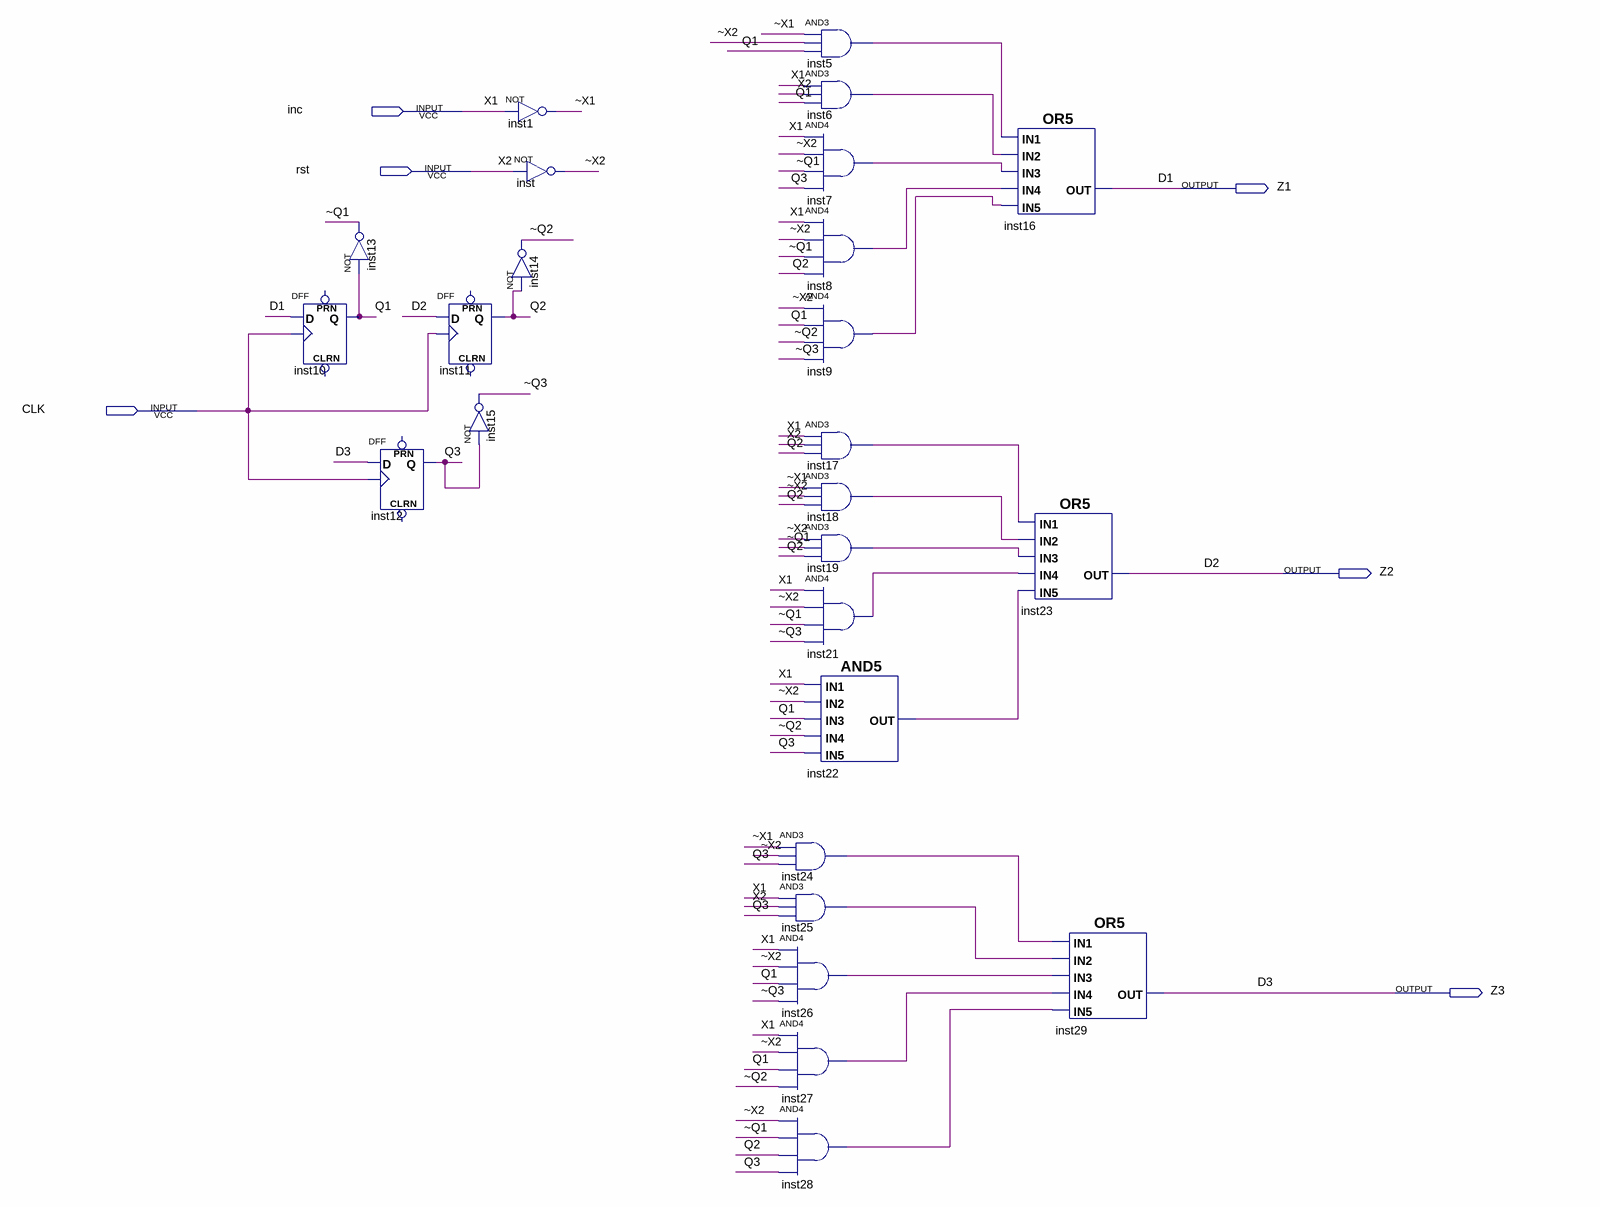
[diagram p0: schematic sheet]
// Quartus schematic PORT_dz2.bdf as structural Verilog: 26 symbols, 6 pins
module PORT_dz2 (
  input  inc,
  input  rst,
  input  CLK,
  output Z1,
  output Z2,
  output Z3
);

  wire inst5_out, inst6_out, inst7_out, inst8_out, inst9_out, inst17_out, inst18_out, inst19_out, inst21_out,
       inst22_out, inst24_out, inst25_out, inst26_out, inst27_out, inst28_out, Q1, Q2, Q3, \~Q1 , \~Q2 ,
       \~Q3 , \~X1 , \~X2 ;

  not inst13 (\~Q1 , Q1);
  DFF inst10 (.CLK(CLK), .D(Z1), .Q(Q1));  // open: CLRN, PRN
  DFF inst12 (.CLK(CLK), .D(Z3), .Q(Q3));  // open: CLRN, PRN
  DFF inst11 (.CLK(CLK), .D(Z2), .Q(Q2));  // open: CLRN, PRN
  not inst15 (\~Q3 , Q3);
  not inst1 (\~X1 , inc);
  not inst (\~X2 , rst);
  not inst14 (\~Q2 , Q2);
  and inst5 (inst5_out, \~X1 , \~X2 , Q1);
  and inst6 (inst6_out, inc, rst, Q1);
  and inst7 (inst7_out, inc, \~X2 , \~Q1 , Q3);
  and inst8 (inst8_out, inc, \~X2 , \~Q1 , Q2);
  and inst9 (inst9_out, \~X2 , Q1, \~Q2 , \~Q3 );
  and inst17 (inst17_out, inc, rst, Q2);
  and inst18 (inst18_out, \~X1 , \~X2 , Q2);
  and inst19 (inst19_out, \~X2 , \~Q1 , Q2);
  and inst21 (inst21_out, inc, \~X2 , \~Q1 , \~Q3 );
  and inst22 (inst22_out, inc, \~X2 , Q1, \~Q2 , Q3);
  and inst24 (inst24_out, \~X1 , \~X2 , Q3);
  and inst25 (inst25_out, inc, rst, Q3);
  and inst26 (inst26_out, inc, \~X2 , Q1, \~Q3 );
  and inst27 (inst27_out, inc, \~X2 , Q1, \~Q2 );
  and inst28 (inst28_out, \~X2 , \~Q1 , Q2, Q3);
  or inst16 (Z1, inst5_out, inst6_out, inst7_out, inst8_out, inst9_out);
  or inst23 (Z2, inst17_out, inst18_out, inst19_out, inst21_out, inst22_out);
  or inst29 (Z3, inst24_out, inst25_out, inst26_out, inst27_out, inst28_out);

  // Other names for the same wires on the sheet: D1 = Z1; D2 = Z2; D3 = Z3; X1 = inc; X2 = rst
endmodule
